# Altium schematic sheet 最小系统.SchDoc
size A4
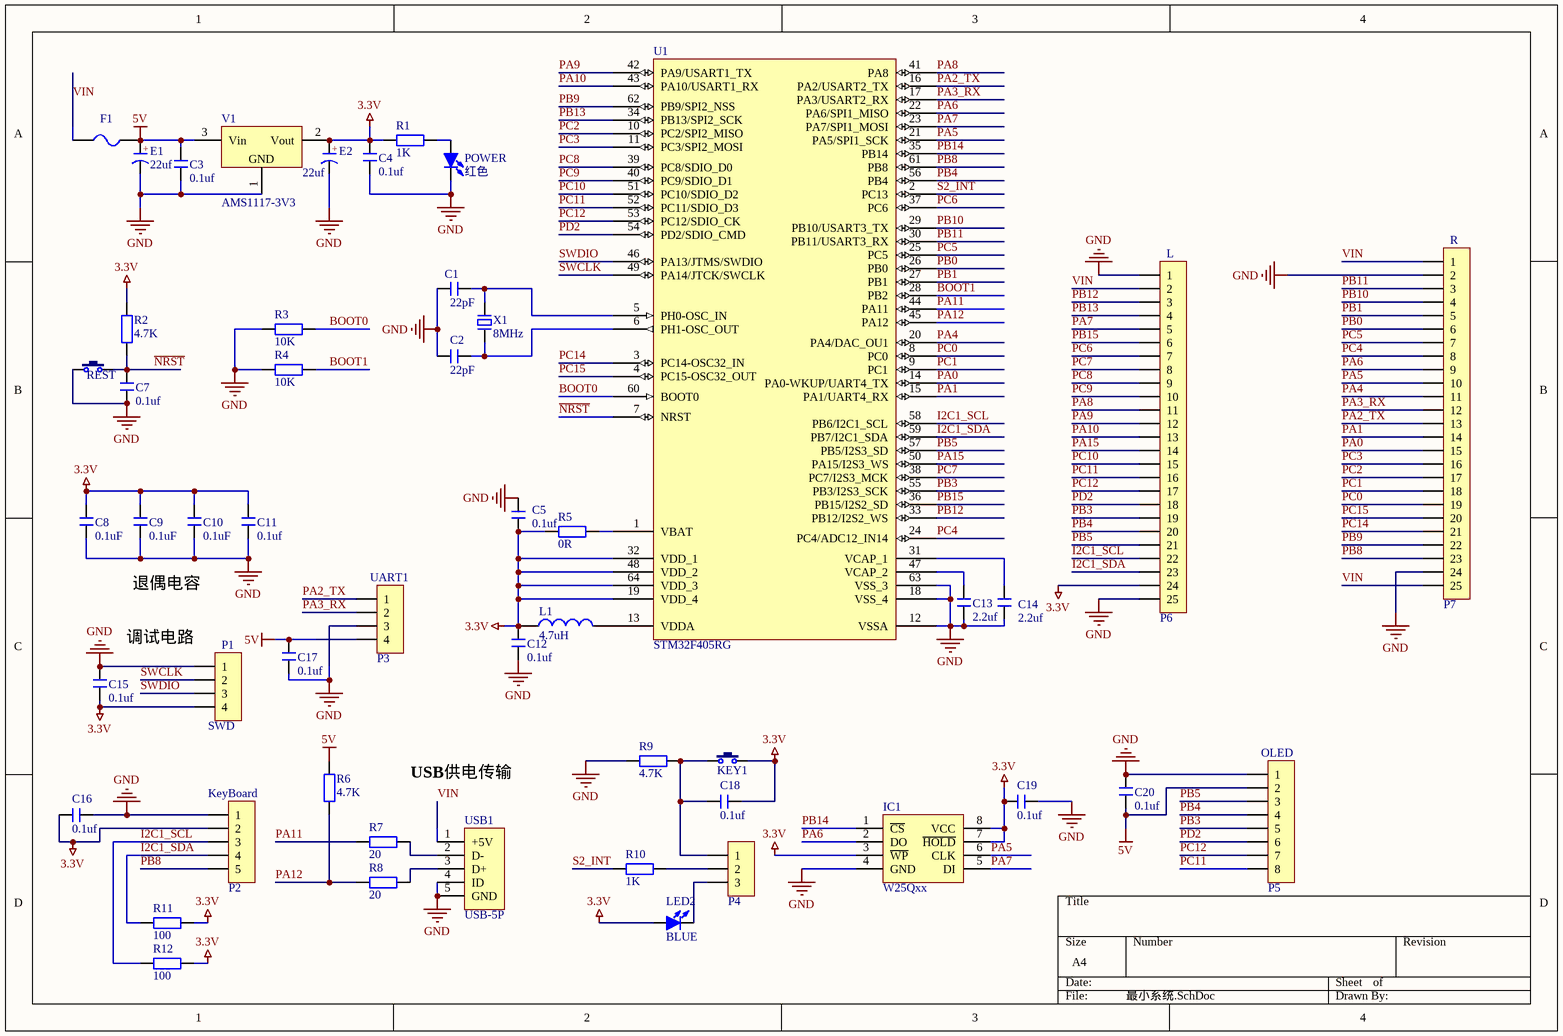
[diagram p0: 最小系统.SchDoc]

## Parts
C1  22pF  [C 0603_M]
C2  22pF  [C 0603_M]
C3  0.1uf  [C 0603_M]
C4  0.1uf  [C 0603_M]
C5  0.1uf  [C 0603_M]
C7  0.1uf  [C 0603_M]
C8  0.1uF  [C 0603_M]
C9  0.1uF  [C 0603_M]
C10  0.1uF  [C 0603_M]
C11  0.1uf  [C 0603_M]
C12  0.1uf  [C 0603_M]
C13  2.2uf  [C 0603_M]
C14  2.2uf  [C 0603_M]
C15  0.1uf  [C 0603_M]
C16  0.1uf  [C 0603_M]
C17  0.1uf  [C 0603_M]
C18  0.1uf  [C 0603_M]
C19  0.1uf  [C 0603_M]
C20  0.1uf  [C 0603_M]
E1  22uf  [CD B(3528)]
E2  22uf  [CD B(3528)]
F1  (no value)  [FU 0603]
IC1  W25Qxx  [SOP8W_L]
KEY1  3x6x5  [TSW SMD-3*6*5]  (value not drawn)
L1  4.7uH  [L 0603]
LED2  BLUE  [LED 0603B]
P1  HDR-1X4  [HDR2.54-LI-4P]  (value not drawn)
P2  HDR-1X5  [HDR2.54-LI-5P]  (value not drawn)
P3  HDR-1X4  [HDR2.54-LI-4P]  (value not drawn)
P4  HDR-1X3  [HDR2.54-LI-3P]  (value not drawn)
P5  HDR-1X8  [HDR2.54-LI-8P]  (value not drawn)
P6  FPC1.0-25P  [HDR2.54-L1-25P]  (value not drawn)
P7  FPC1.0-25P  [HDR2.54-L1-25P]  (value not drawn)
POWER  红色  [LED 0603W]
R1  1K  [R 0603_M]
R2  4.7K  [R 0603_M]
R3  10K  [R 0603_M]
R4  10K  [R 0603_M]
R5  0R  [R 0603_M]
R6  4.7K  [R 0603_M]
R7  20  [R 0603_M]
R8  20  [R 0603_M]
R9  4.7K  [R 0603_M]
R10  1K  [R 0603_M]
R11  100  [R 0603_M]
R12  100  [R 0603_M]
REST  3x6x5  [TSW SMD-3*6*5]  (value not drawn)
U1  STM32F405RG  [LQFP64 10X10_N]
USB1  USB-5P  [USB-MICRO_E]
V1  AMS1117-3V3  [SOT223_L]
X1  8MHz  [OSC 5032-2P]

## Nets
3.3V: C4.2 C5.1 C8.2 C9.2 C10.2 C11.2 C12.2 C15.1 C16.1 C18.2 C19.1 E2.1(A) IC1.3(~{WP}) IC1.7(~{HOLD}) IC1.8(VCC) KEY1.2 L1.1 LED2.1(A) P1.4 P2.2 P6.24 R1.1 R2.2 R5.1 R11.2 R12.2 U1.19(VDD_4) U1.32(VDD_1) U1.48(VDD_2) U1.64(VDD_3) V1.2(Vout)
5V: C3.2 C17.2 C20.1 E1.1(A) F1.2 P3.4 P5.2 R6.2 V1.3(Vin)
GND: C1.1 C2.1 C3.1 C4.1 C5.2 C7.1 C8.1 C9.1 C10.1 C11.1 C12.1 C13.1 C14.1 C15.2 C16.2 C17.1 C19.2 C20.2 E1.2(K) E2.2(K) IC1.4(GND) P1.1 P2.1 P3.3 P5.1 P6.1 P6.25 P7.2 P7.24 POWER.2(K) R3.1 R4.1 R9.1 REST.1 U1.12(VSSA) U1.18(VSS_4) U1.63(VSS_3) USB1.4(ID) USB1.5(GND) V1.1(GND)
BOOT0: R3.2 U1.60(BOOT0)
BOOT1: R4.2 U1.28(PB2)
I2C1_SCL: P2.3 P6.22 R12.1 U1.58(PB6/I2C1_SCL)
I2C1_SDA: P2.4 P6.23 R11.1 U1.59(PB7/I2C1_SDA)
~{NRST}: C7.2 R2.1 REST.2 U1.7(NRST)
PA0: P7.15 U1.14(PA0-WKUP/UART4_TX)
PA1: P7.14 U1.15(PA1/UART4_RX)
PA2_TX: P3.1 P7.13 U1.16(PA2/USART2_TX)
PA3_RX: P3.2 P7.12 U1.17(PA3/USART2_RX)
PA4: P7.11 U1.20(PA4/DAC_OU1)
PA5: IC1.6(CLK) P7.10 U1.21(PA5/SPI1_SCK)
PA6: IC1.2(DO) P7.9 U1.22(PA6/SPI1_MISO)
PA7: IC1.5(DI) P6.5 U1.23(PA7/SPI1_MOSI)
PA8: P6.11 U1.41(PA8)
PA9: P6.12 U1.42(PA9/USART1_TX)
PA10: P6.13 U1.43(PA10/USART1_RX)
PA11: R7.1 U1.44(PA11)
PA12: R6.1 R8.1 U1.45(PA12)
PA15: P6.14 U1.50(PA15/I2S3_WS)
PB0: P7.6 U1.26(PB0)
PB1: P7.5 U1.27(PB1)
PB3: P5.5 P6.19 U1.55(PB3/I2S3_SCK)
PB4: P5.4 P6.20 U1.56(PB4)
PB5: P5.3 P6.21 U1.57(PB5/I2S3_SD)
PB8: P2.5 P7.23 U1.61(PB8)
PB9: P7.22 U1.62(PB9/SPI2_NSS)
PB10: P7.4 U1.29(PB10/USART3_TX)
PB11: P7.3 U1.30(PB11/USART3_RX)
PB12: P6.3 U1.33(PB12/I2S2_WS)
PB13: P6.4 U1.34(PB13/SPI2_SCK)
PB14: IC1.1(~{CS}) U1.35(PB14)
PB15: P6.6 U1.36(PB15/I2S2_SD)
PC0: P7.19 U1.8(PC0)
PC1: P7.18 U1.9(PC1)
PC2: P7.17 U1.10(PC2/SPI2_MISO)
PC3: P7.16 U1.11(PC3/SPI2_MOSI)
PC4: P7.8 U1.24(PC4/ADC12_IN14)
PC5: P7.7 U1.25(PC5)
PC6: P6.7 U1.37(PC6)
PC7: P6.8 U1.38(PC7/I2S3_MCK)
PC8: P6.9 U1.39(PC8/SDIO_D0)
PC9: P6.10 U1.40(PC9/SDIO_D1)
PC10: P6.15 U1.51(PC10/SDIO_D2)
PC11: P5.8 P6.16 U1.52(PC11/SDIO_D3)
PC12: P5.7 P6.17 U1.53(PC12/SDIO_CK)
PC14: P7.21 U1.3(PC14-OSC32_IN)
PC15: P7.20 U1.4(PC15-OSC32_OUT)
PD2: P5.6 P6.18 U1.54(PD2/SDIO_CMD)
S2_INT: R10.2 U1.2(PC13)
SWCLK: P1.2 U1.49(PA14/JTCK/SWCLK)
SWDIO: P1.3 U1.46(PA13/JTMS/SWDIO)
VIN: F1.1 P6.2 P7.1 P7.25 USB1.1(+5V)
NetC1_2: C1.2 U1.5(PH0-OSC_IN) X1.2
NetC2_2: C2.2 U1.6(PH1-OSC_OUT) X1.1
NetC13_2: C13.2 U1.47(VCAP_2)
NetC14_2: C14.2 U1.31(VCAP_1)
NetC18_1: C18.1 KEY1.1 P4.1 R9.2
NetL1_2: L1.2 U1.13(VDDA)
NetLED2_2: LED2.2(K) P4.3
NetP4_2: P4.2 R10.1
NetPOWER_1: POWER.1(A) R1.2
NetR5_2: R5.2 U1.1(VBAT)
NetR7_2: R7.2 USB1.2(D-)
NetR8_2: R8.2 USB1.3(D+)

## Notes on the sheet
- (near P7) R
- (near P6) L
- (near P3) UART1
- (near P1) 调试电路
- 退偶电容
- (near P1) SWD
- USB供电传输
- (near P5) OLED
- (near P2) KeyBoard
- (in symbol C-CD) +

## Library data of the parts
C1-C5 C7-C20 = C: 无极性贴片电容; 版权归属: 源创客; BOM名称: 无极性贴片电容; 学习资源: www.ooocke.com
E1 E2 = C-CD: 贴片钽电容; 版权归属: 源创客; BOM名称: 贴片钽电容; 学习资源: www.ooocke.com
F1 = FU: 贴片保险丝; 版权归属: 源创客; BOM名称: 贴片保险丝; 学习资源: www.ooocke.com
IC1 = W25Qxx: 外置Flash; 版权归属: 源创客; BOM名称: 外置Flash; 学习资源: www.ooocke.com
KEY1 REST = TSW 3x6: 3x6轻触开关; 版权归属: 源创客; BOM名称: 3x6轻触开关; 学习资源: www.ooocke.com
L1 = L: 小功率贴片电感; 版权归属: 源创客; BOM名称: 小功率贴片电感; 学习资源: www.ooocke.com
LED2 POWER = LED-SMD: 贴片LED; 版权归属: 源创客; BOM名称: 贴片LED; 学习资源: www.ooocke.com
P1 P3 = Header 4: 4P接插件; 版权归属: 源创客; BOM名称: 4P接插件; 学习资源: www.ooocke.com
P2 = Header 5: 5P接插件; 版权归属: 源创客; BOM名称: 5P接插件; 学习资源: www.ooocke.com
P4 = Header 3: 3P接插件; 版权归属: 源创客; BOM名称: 3P接插件; 学习资源: www.ooocke.com
P5 = Header 8: 8P接插件; 版权归属: 源创客; BOM名称: 8P接插件; 学习资源: www.ooocke.com
P6 P7 = FPC-25P: FPC连接器; 版权归属: 源创客; BOM名称: FPC连接器; 学习资源: www.ooocke.com
R1-R12 = R: 贴片电阻; 版权归属: 源创客; BOM名称: 贴片电阻; 学习资源: www.ooocke.com
U1 = STM32F205RG: 32位STM单片机; 版权归属: 源创客; BOM名称: 32位STM单片机; 学习资源: www.ooocke.com
USB1 = USB-5P: 微型USB母座; 版权归属: 源创客; BOM名称: 微型USB母座; 学习资源: www.ooocke.com
V1 = AMS1117: 三端稳压芯片; BOM名称: 稳压芯片; 版权归属: 源创客; 学习资源: www.ooocke.com
X1 = XTAL-2P: 2脚无源脚晶振; 版权归属: 源创客; BOM名称: 2脚无源脚晶振; 学习资源: www.ooocke.com